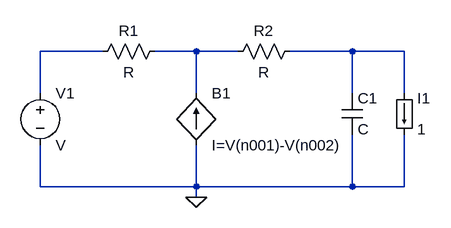
[diagram p0: schematic Q6 at3.asc]
Q6 at3.asc, the LTspice schematic file:
Version 4.1
SHEET 1 880 680
WIRE -16 80 -112 80
WIRE 128 80 64 80
WIRE 192 80 128 80
WIRE 368 80 272 80
WIRE 448 80 368 80
WIRE -112 144 -112 80
WIRE 128 144 128 80
WIRE 368 144 368 80
WIRE 448 144 448 80
WIRE -112 288 -112 224
WIRE 128 288 128 224
WIRE 128 288 -112 288
WIRE 368 288 368 208
WIRE 368 288 128 288
WIRE 448 288 448 208
WIRE 448 288 368 288
WIRE 128 304 128 288
FLAG 128 304 0
SYMBOL voltage -112 128 R0
SYMATTR InstName V1
SYMBOL res 80 64 R90
WINDOW 0 0 56 VBottom 2
WINDOW 3 32 56 VTop 2
SYMATTR InstName R1
SYMBOL res 288 64 R90
WINDOW 0 0 56 VBottom 2
WINDOW 3 32 56 VTop 2
SYMATTR InstName R2
SYMBOL cap 352 144 R0
SYMATTR InstName C1
SYMBOL bi2 128 144 R0
SYMATTR InstName B1
SYMATTR Value I=V(n001)-V(n002)
SYMBOL load 432 144 R0
WINDOW 123 0 0 Left 0
WINDOW 39 0 0 Left 0
SYMATTR InstName I1
SYMATTR Value 1

The netlist it stands for:
* Q6 at3.asc
V1 N001 0 V
R1 N002 N001 R
R2 N003 N002 R
C1 N003 0 C
B1 0 N002 I=V(n001)-V(n002)
I1 N003 0 1
.backanno
.end